# EAGLE design voltage-booster-mic2145 (EAGLE 9.6.2)
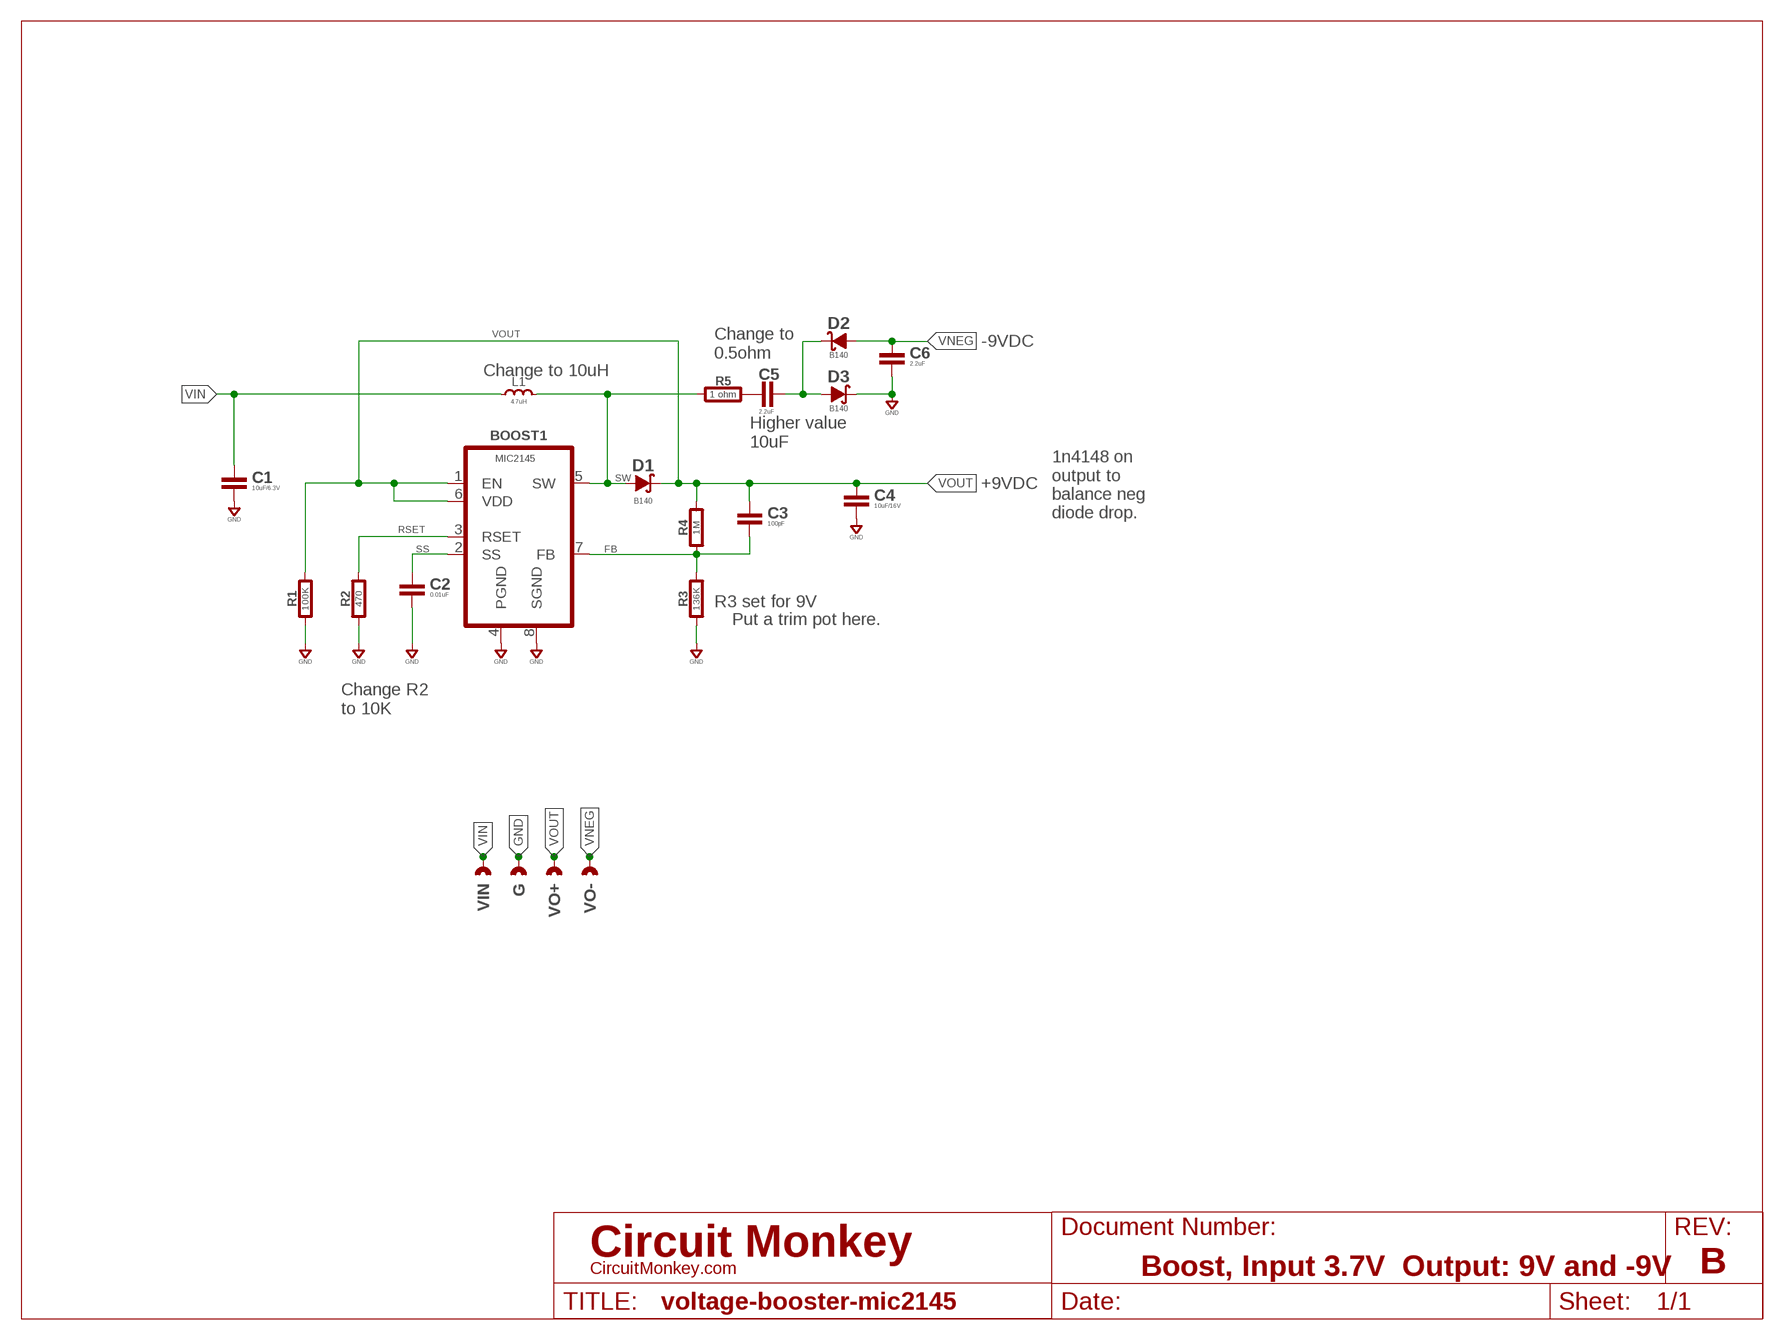
[diagram p0: schematic, sheet 1]
SHEET1 (LETTER_L-CIRCUITMONKEY): DOCUMENT_NUMBER: Boost, Input 3.7V Output: 9V and -9V; REV: B

## Parts
BOOST1  MIC2145  BOOST-MIC2145-MSOP  [MSOP8-0.65]
C1  10uF/6.3V  CAPACITOR0603  [0603-CAP]
C2  0.01uF  CAPACITOR0603  [0603-CAP]
C3  100pF  CAPACITOR0603  [0603-CAP]
C4  10uF/16V  CAPACITOR0603  [0603-CAP]
C5  2.2uF  CAPACITOR0603  [0603-CAP]
C6  2.2uF  CAPACITOR0603  [0603-CAP]
D1  B140  SCHOTTKYB140  [SMA]
D2  B140  SCHOTTKYB140  [SMA]
D3  B140  SCHOTTKYB140  [SMA]
G  CAST-01X12.54MM  [CAST01-2.54MM]
L1  4.7uH  INDUCTORSMD-05X04MM  [IND-SRN5040]
R1  100K  RESISTOR0603  [0603-RES]
R2  470  RESISTOR0603  [0603-RES]
R3  136K  RESISTOR0603  [0603-RES]
R4  1M  RESISTOR0603  [0603-RES]
R5  1 ohm  RESISTOR0603  [0603-RES]
VIN  CAST-01X12.54MM  [CAST01-2.54MM]
VO+  CAST-01X12.54MM  [CAST01-2.54MM]
VO-  CAST-01X12.54MM  [CAST01-2.54MM]

## Nets
FB: BOOST1.7(FB) C3.2 R3.2 R4.1
GND: BOOST1.4(PGND) BOOST1.8(SGND) C1.2 C2.2 C4.2 C6.2 D3.K G.1 R1.1 R2.1 R3.1
N$1: C5.1 R5.2
N$2: C5.2 D2.K D3.A
RSET: BOOST1.3(RSET) R2.2
SS: BOOST1.2(SS) C2.1
SW: BOOST1.5(SW) D1.A L1.1 R5.1
VIN: C1.1 L1.2 VIN.1
VNEG: C6.1 D2.A VO-.1
VOUT: BOOST1.1(EN) BOOST1.6(VDD) C3.1 C4.1 D1.K R1.2 R4.2 VO+.1

## Notes on the sheet
- -9VDC
- Change to
  0.5ohm
- Change to 10uH
- Higher value
  10uF
- +9VDC
- 1n4148 on
  output to
  balance neg
  diode drop.
- R3 set for 9V
- Put a trim pot here.
- Change R2
  to 10K

## Library data of the parts
BOOST1 = regulators:BOOST-MIC2145: Micrel 2145 Boost Converter; COST01: 2.75; COST10: 2.71; COST100: 2.70; MFR: Micrel; MPN: MIC2145YMM
C1-C6 = rlc:CAPACITOR: Capacitor; COST01: 0.12; COST10: 0.09; COST100: 0.05
D1-D3 = diodes:SCHOTTKY: Schottky Diodes; COST01: 0.38; COST10: 0.28; COST100: 0.18; MFR: Vishay/Various; MPN: B140
G VIN VO+ VO- = con-headers:CAST-01X1: Castelated Edge Hole Pad
L1 = rlc:INDUCTOR: Inductor; MFR: Bourns; MPN: SRN5040
R1-R5 = rlc:RESISTOR: Resistor; COST01: 0.10; COST10: 0.05; COST100: 0.02

## Board
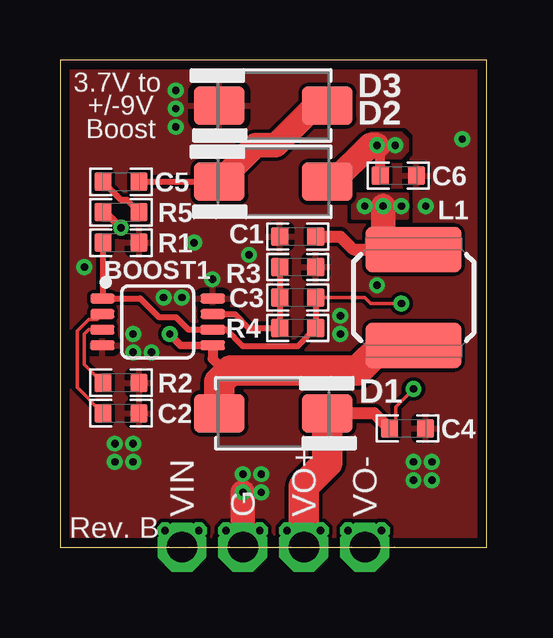
[diagram p1: board, top side]
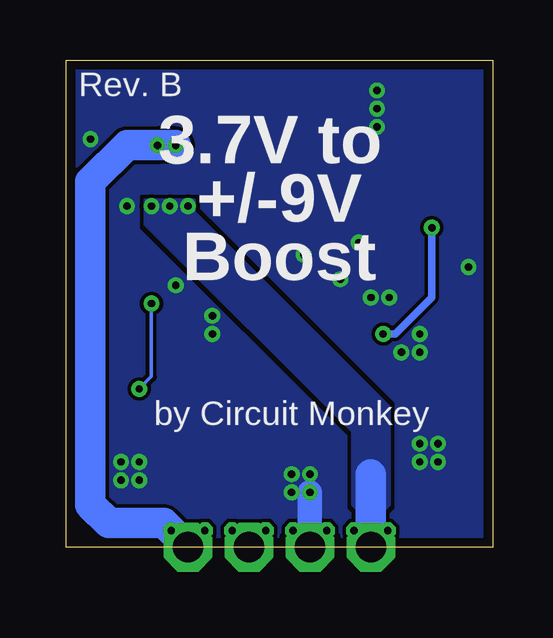
[diagram p2: board, bottom side, seen from below]

Size 17.78 x 20.32 mm. Coordinates in mm from the lower left corner, seen from the top.
Outline: 0,0 17.78,0 17.78,20.32 0,20.32 0,0
Copper layers (1*16): Top 0.0356mm / dielectric 1.5011mm / Bottom 0.0356mm
Design rules "OSH-CircuitMonkey *": minimum track width 6mil, minimum drill 12mil, track to track 6mil, track to pad 6mil, pad to pad 6mil, via to via 6mil, smd to smd 6mil, copper to edge 15mil, drill to drill 6mil, minimum pad ring 7mil, minimum via ring 7mil, stop-mask expansion 3mil, vias tented up to drill 13mil, thermal gap 10mil

### Footprints (pad centres in the part's own frame; a part is rotated, then mirrored left to right if it is on the bottom)
MSOP8-0.65 = smd 1 x 0.4: 1 -2.3,0.975; 2 -2.3,0.325; 3 -2.3,-0.325; 4 -2.3,-0.975; 5 2.3,-0.975; 6 2.3,-0.325; 7 2.3,0.325; 8 2.3,0.975
0603-CAP = smd 0.711 x 0.762: 1 -0.752,0; 2 0.752,0
SMA = smd 2.1 x 1.6: A -2.25,0; K 2.25,0
CAST01-2.54MM = drill 1.27 pad 2.032 octagon: 1 0,0 | drill 0.305 octagon: P$1 -0.7,0.7; P$2 -0.7,-0.7
IND-SRN5040 = smd 1.9 x 4: 1 -2,0; 2 2,0
0603-RES = smd 0.711 x 0.762: 1 -0.752,0; 2 0.752,0

### Placement (x,y rotation side)
BOOST1  4.06,9.4 0 top
C1  9.91,12.95 180 top
C2  2.54,5.59 0 top
C3  9.91,10.41 180 top
C4  14.48,4.95 0 top
C5  2.54,15.24 0 top
C6  14.1,15.49 0 top
D1  8.89,5.59 0 top
D2  8.89,15.24 180 top
D3  8.89,18.41 180 top
G  7.62,0 270 top
L1  14.73,10.41 90 top
R1  2.54,12.7 180 top
R2  2.54,6.86 180 top
R3  9.91,11.68 180 top
R4  9.91,9.14 0 top
R5  2.54,13.97 0 top
VIN  5.08,0 270 top
VO+  10.16,0 270 top
VO-  12.7,0 270 top

### Tracks (layer width: path | path; a pad name or v marks a point on that pad's centre or on a via)
FB
  Top 0.254: R3.2 C3.2 R4.1 7.87,9.14 7.29,9.72 BOOST1.7
GND  (via drill 0.3)
  Top 1.016: G.1 v7.62,2.29
  Bottom 1.016: G.1 v7.62,2.29
  other vias: 3.05,8.13 3.81,8.13 3.05,8.89 5.08,10.41 6.35,11.18 3.05,4.32 2.29,4.32 3.05,3.56 14.73,2.79 15.49,3.56 15.49,2.79 5.59,12.7 1.02,11.68 8.38,2.29 7.62,3.05 8.38,3.05 2.29,3.56 14.73,3.56 4.83,19.05 4.83,18.29 4.83,17.53 7.87,12.19 15.24,14.22 16.76,17.02 13.21,10.92 11.68,9.65 11.68,8.89 4.32,10.41
  pour Top (rank 5): 0,0 0,20.32 17.78,20.32 17.78,0
  pour Bottom (rank 5): 0,0 0,20.32 17.78,20.32 17.78,0
N$1
  Top 0.254: C5.1 2.55,14.48 2.78,14.48 R5.2
N$2
  Top 0.254: C5.2 D2.K
  Top 1.016: D3.A 10.63,18.41 8.98,16.76 8.16,16.76 D2.K
RSET
  Top 0.152: R2.2 1.02,7.63 1.02,8.89 1.2,9.07 BOOST1.3
SS
  Top 0.152: BOOST1.2 1.54,9.5 1.2,9.5 0.71,9.02 0.71,6.67 C2.1
SW  (via drill 0.3)
  Top 0.305: BOOST1.5 5.04,8.42 v4.57,8.89 | v2.54,13.33 1.9,13.97 R5.1
  Top 0.406: BOOST1.5 6.36,7.86 6.99,7.24
  Top 1.27: L1.1 13.46,8.41 12.41,7.37 7.11,7.37 6.99,7.24 6.64,6.89 D1.A
  Bottom 0.305: v4.57,8.89 4.06,8.89 2.54,10.41 v2.54,13.33
VIN  (via drill 0.3)
  Top 0.508: C1.1 11.68,12.95 12.22,12.41 13.46,12.41 L1.2
  Top 1.016: v13.46,14.22 13.46,12.41
  Bottom 1.27: VIN.1 5.08,3.05
  other vias: 12.7,14.22 14.22,14.22
  pour Bottom: 4.57,1.52 5.59,1.52 5.84,1.78 5.84,4.83 14.48,13.46 14.48,14.48 12.45,14.48 12.45,13.97 4.32,5.84 4.32,1.78
  pour Top: 14.48,13.72 14.48,14.73 12.19,14.73 12.19,13.72
VNEG  (via drill 0.3)
  Top 0.406: C6.1 13.35,16.39 13.72,16.76 v13.97,16.76
  Top 1.016: D2.A 11.39,15.24 12.92,16.76 v13.21,16.76
  Bottom 1.27: VO-.1 13.72,1.02 16,1.02 16.76,1.78 16.76,15.24 15.24,16.76 v13.97,16.76 v13.21,16.76
  pour Top: 14.48,17.02 14.22,17.27 12.95,17.27 12.95,16.26 14.22,16.26 14.48,16.51
VOUT  (via drill 0.3)
  Top 0.152: C4.1 13.98,5.21 13.98,5.85 v14.73,6.6 | v14.22,10.16 12.94,10.16 12.69,10.41 C3.1
  Top 0.254: R1.2 1.79,10.4 BOOST1.1 3.34,10.37 4.13,9.58 4.84,9.58 5.35,9.07 BOOST1.6 6.93,9.07 7.62,8.38 9.9,8.38 R4.2 C3.1
  Top 0.508: C4.1 13.09,5.59 D1.K
  Top 1.27: D1.K 11.14,3.52 10.16,2.54 VO+.1
  Bottom 0.152: v14.73,6.6 14.22,7.11 v14.22,10.16

### Text on the board
tPlace: 3.7V to / +/-9V / Boost | Rev. B
bPlace: Rev. B | 3.7V to / +/-9V / Boost | by Circuit Monkey